# EAGLE design Configurable_RC_Filter (EAGLE 9.5.2)
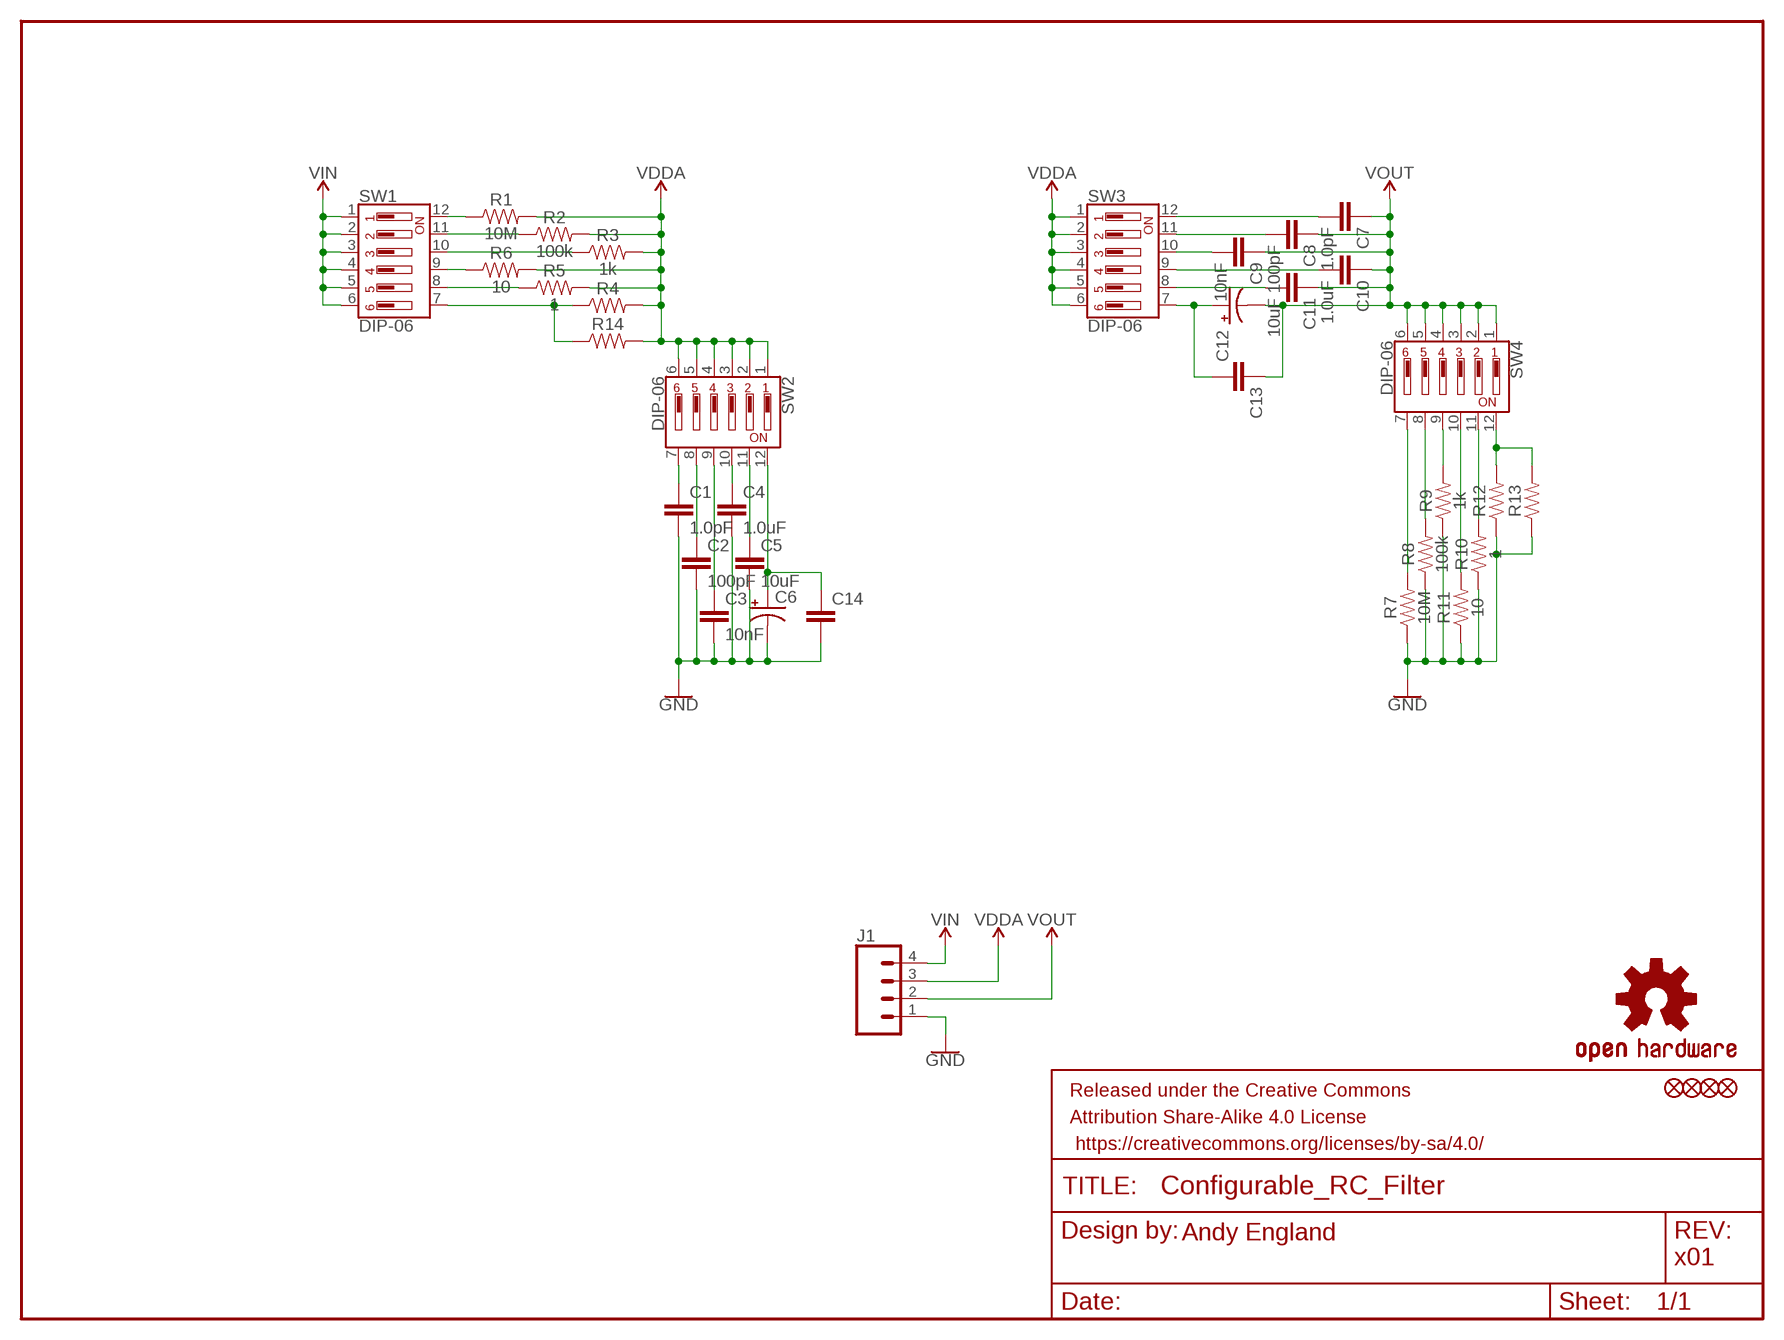
[diagram p0: schematic, sheet 1]

## Parts
C1  1.0pF  1.0PF-0603-50V-25%  [0603]
C2  100pF  100PF-0603-50V-5%  [0603]
C3  10nF  10NF-0603-50V-10%  [0603]
C4  1.0uF  1.0UF-0603-16V-10%  [0603]
C5  10uF  10UF-0603-6.3V-20%  [0603]
C6  1000UF-RADIAL-5MM-25V-20%-NO-SILK  [CPOL-RADIAL-5MM-10MM-NS]
C7  1.0pF  1.0PF-0603-50V-25%  [0603]
C8  100pF  100PF-0603-50V-5%  [0603]
C9  10nF  10NF-0603-50V-10%  [0603]
C10  1.0uF  1.0UF-0603-16V-10%  [0603]
C11  10uF  10UF-0603-6.3V-20%  [0603]
C12  1000UF-RADIAL-5MM-25V-20%-NO-SILK  [CPOL-RADIAL-5MM-10MM-NS]
C13  CAP-0603  [0603]
C14  CAP-0603  [0603]
FD1  FIDUCIAL1X2  [FIDUCIAL-1X2]
FD2  FIDUCIAL1X2  [FIDUCIAL-1X2]
FD3  FIDUCIAL1X2  [FIDUCIAL-1X2]
FD4  FIDUCIAL1X2  [FIDUCIAL-1X2]
FRAME1  FRAME-LETTER  [CREATIVE_COMMONS]
J1  CONN_041X04_NO_SILK  [1X04_NO_SILK]
LOGO1  OSHW-LOGOS  [OSHW-LOGO-S]
R1  10M  10MOHM-0603-1/10W-5%  [0603]
R2  100k  100KOHM-0603-1/10W-1%  [0603]
R3  1k  1KOHM-0603-1/10W-1%  [0603]
R4  RESISTORAXIAL-0.3  [AXIAL-0.3]
R5  1  1OHM-0603-1/10W-1%  [0603]
R6  10  10OHM-0603-1/10W-1%  [0603]
R7  10M  10MOHM-0603-1/10W-5%  [0603]
R8  100k  100KOHM-0603-1/10W-1%  [0603]
R9  1k  1KOHM-0603-1/10W-1%  [0603]
R10  1  1OHM-0603-1/10W-1%  [0603]
R11  10  10OHM-0603-1/10W-1%  [0603]
R12  RESISTORAXIAL-0.3  [AXIAL-0.3]
R13  RESISTOR0603  [0603]
R14  RESISTOR0603  [0603]
SW1  DIP-06  [DIPSWITCH-06-SMD]
SW2  DIP-06  [DIPSWITCH-06-SMD]
SW3  DIP-06  [DIPSWITCH-06-SMD]
SW4  DIP-06  [DIPSWITCH-06-SMD]

## Nets
GND: C1.2 C2.2 C3.2 C4.2 C5.2 C6.- C14.2 J1.1 R7.1 R8.1 R9.1 R10.1 R11.1 R12.P$1 R13.1
N$1: R1.1 SW1.12
N$2: R2.1 SW1.11
N$3: C1.1 SW2.7
N$4: R3.1 SW1.10
N$5: R6.1 SW1.9
N$6: R5.1 SW1.8
N$7: R4.P$1 R14.1 SW1.7
N$8: C2.1 SW2.8
N$9: C3.1 SW2.9
N$10: C4.1 SW2.10
N$11: C5.1 SW2.11
N$12: C6.+ C14.1 SW2.12
N$13: C12.+ C13.2 SW3.7
N$14: C11.2 SW3.8
N$15: C10.2 SW3.9
N$16: C9.2 SW3.10
N$17: C8.2 SW3.11
N$18: C7.2 SW3.12
N$19: R7.2 SW4.7
N$20: R8.2 SW4.8
N$21: R9.2 SW4.9
N$22: R12.P$2 R13.2 SW4.12
N$23: R10.2 SW4.11
N$24: R11.2 SW4.10
VDDA: J1.3 R1.2 R2.2 R3.2 R4.P$2 R5.2 R6.2 R14.2 SW2.1 SW2.2 SW2.3 SW2.4 SW2.5 SW2.6 SW3.1 SW3.2 SW3.3 SW3.4 SW3.5 SW3.6
VIN: J1.4 SW1.1 SW1.2 SW1.3 SW1.4 SW1.5 SW1.6
VOUT: C7.1 C8.1 C9.1 C10.1 C11.1 C12.- C13.1 J1.2 SW4.1 SW4.2 SW4.3 SW4.4 SW4.5 SW4.6

## Notes on the sheet
- Andy England
- x01

## Library data of the parts
C1 C7 = SparkFun-Capacitors:1.0PF: 1pF ceramic capacitors A capacitor is a passive two-terminal electrical component used to store electrical energy temporarily in an electric field.; PROD_ID: CAP-07879
C2 C8 = SparkFun-Capacitors:100PF: 100pF/0.1nF ceramic capacitors A capacitor is a passive two-terminal electrical component used to store electrical energy temporarily in an electric field.; PROD_ID: CAP-07883
C3 C9 = SparkFun-Capacitors:10NF: 0.01uF/10nF/10,000pF ceramic capacitors A capacitor is a passive two-terminal electrical component used to store electrical energy temporarily in an electric field. CAP-09321; PROD_ID: CAP-00867
C4 C10 = SparkFun-Capacitors:1.0UF: 1µF ceramic capacitors A capacitor is a passive two-terminal electrical component used to store electrical energy temporarily in an electric field.; PROD_ID: CAP-00868
C5 C11 = SparkFun-Capacitors:10UF: 10.0µF ceramic capacitors A capacitor is a passive two-terminal electrical component used to store electrical energy temporarily in an electric field.; PROD_ID: CAP-11015
C6 C12 = SparkFun-Capacitors:1000UF: 1,000µF/1mF ceramic capacitors A capacitor is a passive two-terminal electrical component used to store electrical energy temporarily in an electric field. CAP-08070
C13 C14 = SparkFun-Capacitors:CAP
FD1-FD4 = SparkFun-Aesthetics:FIDUCIAL: Fiducial Alignment Points Point-of-reference for pick-and-place machines and other optical instruments.
FRAME1 = SparkFun-Aesthetics:FRAME-LETTER: Schematic Frame - Letter Standard 8.5x11 US Letter frame
J1 = SparkFun-Connectors:CONN_04: Multi connection point. Often used as Generic Header-pin footprint for 0.1 inch spaced/style header connections On any of the 0.1 inch spaced packages, you can populate with these: Break Away Headers - Straight <https://www.sparkfun.com/products/116> (PRT-00116) Break Away Male Headers - Right Angle <https://www.sparkfun.com/products/553> (PRT-00553) Female Headers <https://www.sparkfun.com/products/115> (PRT-00115) Break Away Headers - Machine Pin <https://www.sparkfun.com/products/117> (PRT-00117) Break Away Female Headers - Swiss Machine Pin <https://www.sparkfun.com/products/743> (PRT-00743) For SCREWTERMINALS and SPRING TERMINALS visit here: Screw Terimnals on SparkFun.com <https://www.sparkfun.com/search/results?term=Screw+Terminals> (5mm/3.5mm/2.54mm spacing) This device is also useful as a general connection point to wire up your design to another part of your project. Our various solder wires solder well into these plated through hole pads. Hook-Up Wire - Assortment (Stranded, 22 AWG) <https://www.sparkfun.com/products/11375> (PRT-11375) Hook-Up Wire - Assortment (Solid Core, 22 AWG) <https://www.sparkfun.com/products/11367> (PRT-11367) View the entire wire category on our website here <https://www.sparkfun.com/categories/141> Special notes: Molex polarized connector foot print use with SKU : PRT-08231 with associated crimp pins and housings. 1MM SMD Version SKU: PRT-10208; PROD_ID: CONN-09696
LOGO1 = SparkFun-Aesthetics:OSHW-LOGO: Open-Source Hardware (OSHW) Logo This logo indicates the piece of hardware it is found on incorporates a OSHW license and/or adheres to the definition of open source hardware found here: http://freedomdefined.org/OSHW
R1 R7 = SparkFun-Resistors:10MOHM: RES-09327; PROD_ID: RES-08283
R2 R8 = SparkFun-Resistors:100KOHM: 100kΩ resistor A resistor is a passive two-terminal electrical component that implements electrical resistance as a circuit element. Resistors act to reduce current flow, and, at the same time, act to lower voltage levels within circuits. - Wikipedia; PROD_ID: RES-07828
R3 R9 = SparkFun-Resistors:1KOHM: 1kΩ resistor A resistor is a passive two-terminal electrical component that implements electrical resistance as a circuit element. Resistors act to reduce current flow, and, at the same time, act to lower voltage levels within circuits. - Wikipedia; PROD_ID: RES-07856
R4 R12-R14 = SparkFun-Resistors:RESISTOR: Generic Resistor Package
R5 R10 = SparkFun-Resistors:1OHM: 1Ω resistor A resistor is a passive two-terminal electrical component that implements electrical resistance as a circuit element. Resistors act to reduce current flow, and, at the same time, act to lower voltage levels within circuits. - Wikipedia; PROD_ID: RES-08269
R6 R11 = SparkFun-Resistors:10OHM: 10Ω resistor A resistor is a passive two-terminal electrical component that implements electrical resistance as a circuit element. Resistors act to reduce current flow, and, at the same time, act to lower voltage levels within circuits. - Wikipedia; PROD_ID: RES-12581
SW1-SW4 = SparkFun-Switches:DIP-06; PROD_ID: SWCH-13756

## Board
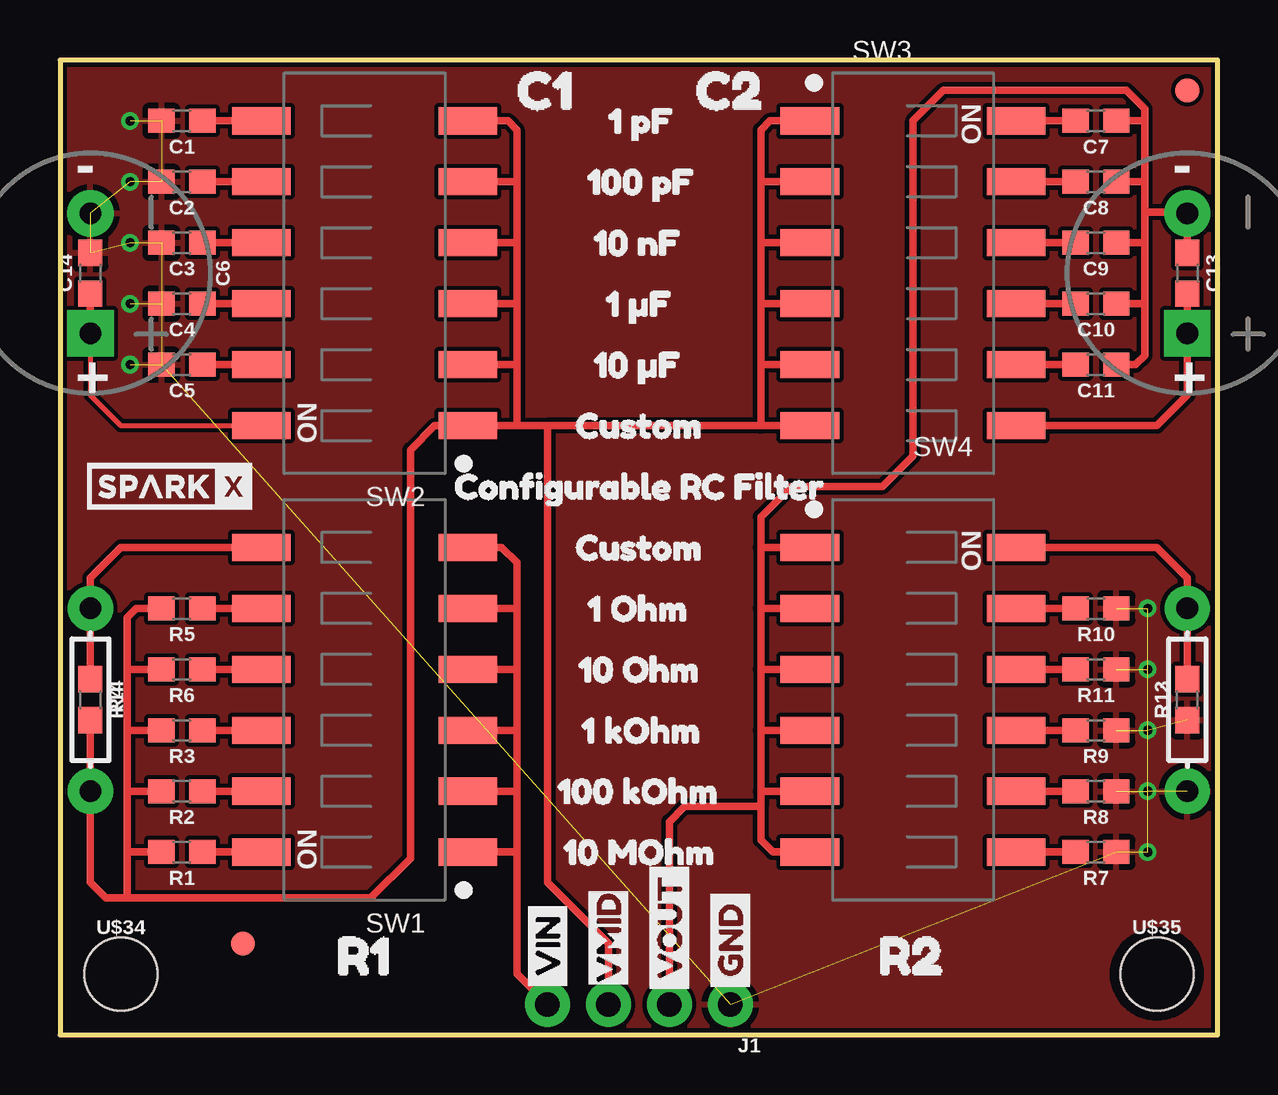
[diagram p1: board, top side]
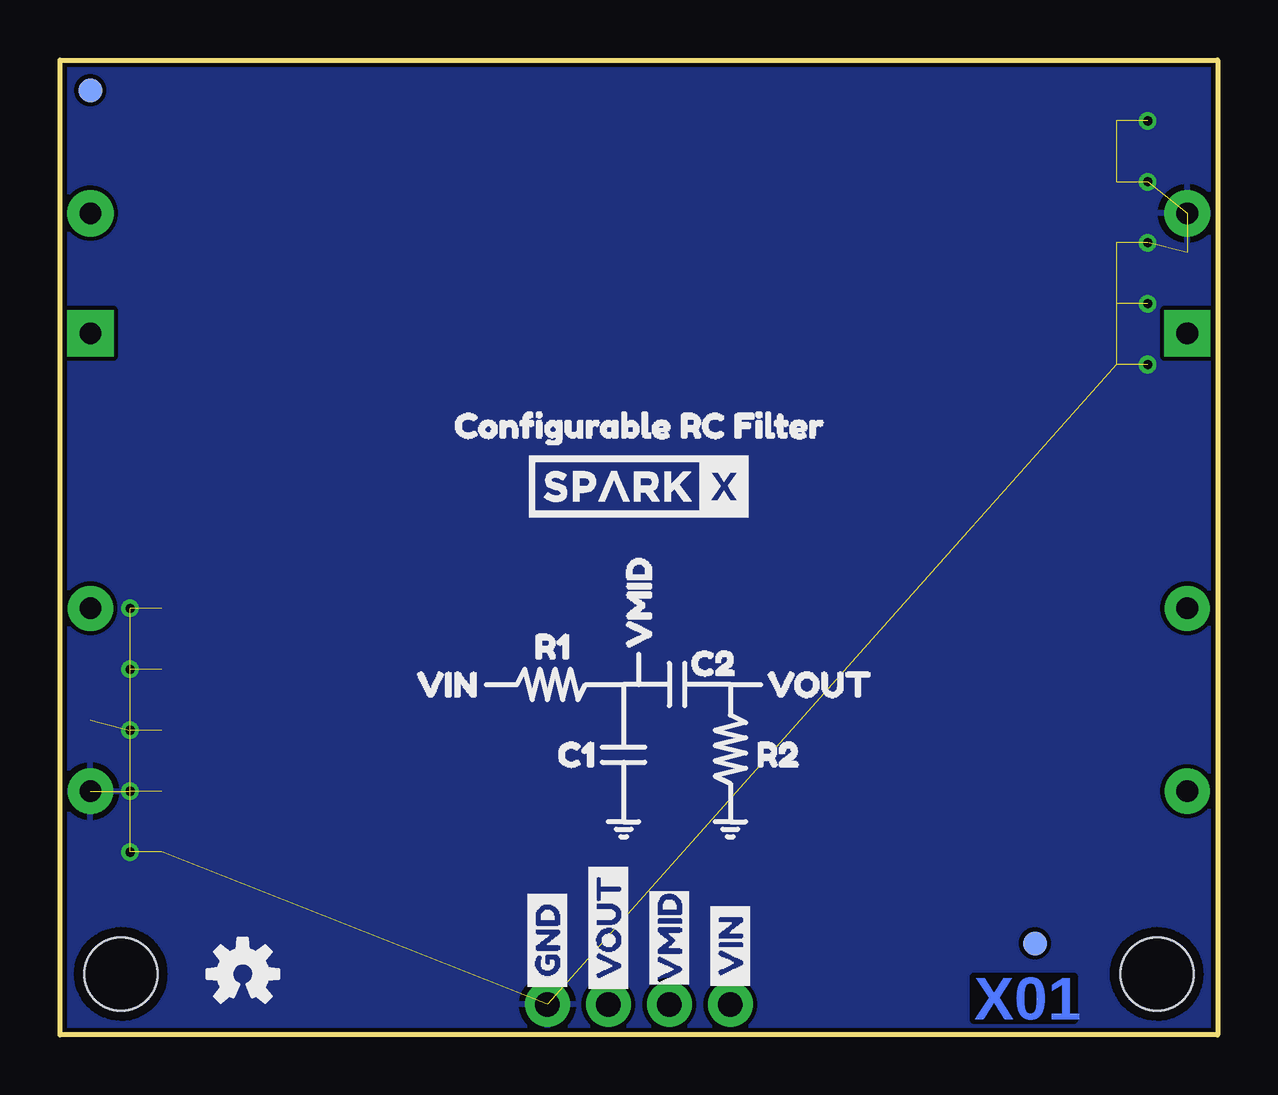
[diagram p2: board, bottom side, seen from below]

Size 48.26 x 40.64 mm. Coordinates in mm from the lower left corner, seen from the top.
Outline: 0,0 48.26,0 48.26,40.64 0.01,40.64 0,0
Copper layers (1*16): Top 0.035mm / dielectric 1.5mm / Bottom 0.035mm
Design rules "SparkFun-2-layer-TIGHT": minimum track width 7mil, minimum drill 15mil, track to track 7mil, track to pad 7mil, pad to pad 7mil, via to via 7mil, smd to smd 7mil, copper to edge 7mil, drill to drill 7mil, minimum pad ring 7mil, minimum via ring 7mil, stop-mask expansion 4mil, vias tented up to drill 25mil, thermal gap 10mil

### Footprints (pad centres in the part's own frame; a part is rotated, then mirrored left to right if it is on the bottom)
0603 = smd 1.1 x 1: 1 -0.85,0; 2 0.85,0
CPOL-RADIAL-5MM-10MM-NS = drill 0.9 pad 1.93 square: + 2.5,0 | drill 0.9 pad 1.93: - -2.5,0
FIDUCIAL-1X2 = smd 1 x 1: 1 0,0
1X04_NO_SILK = drill 1.016 pad 1.88: 1 0,0; 2 2.54,0; 3 5.08,0; 4 7.62,0
AXIAL-0.3 = drill 0.9 pad 1.88: P$1 -3.81,0; P$2 3.81,0
DIPSWITCH-06-SMD = smd 1.13 x 2.44: 1 -6.35,-4.3; 2 -3.81,-4.3; 3 -1.27,-4.3; 4 1.27,-4.3; 5 3.81,-4.3; 6 6.35,-4.3; 7 6.35,4.3; 8 3.81,4.3; 9 1.27,4.3; 10 -1.27,4.3; 11 -3.81,4.3; 12 -6.35,4.3
STAND-OFF-TIGHT = hole 3.048: 0,0

### Placement (x,y rotation side)
C1  5.08,38.1 180 top
C2  5.08,35.56 180 top
C3  5.08,33.02 180 top
C4  5.08,30.48 180 top
C5  5.08,27.94 180 top
C6  1.27,31.75 270 top
C7  43.18,38.1 180 top
C8  43.18,35.56 180 top
C9  43.18,33.02 180 top
C10  43.18,30.48 180 top
C11  43.18,27.94 180 top
C12  46.99,31.75 270 top
C13  46.99,31.75 270 top
C14  1.27,31.75 90 top
FD1  7.62,3.81 0 top
FD2  7.62,3.81 0 bottom
FD3  46.99,39.37 0 top
FD4  46.99,39.37 0 bottom
FRAME1  -1.27,-8.89 0 top  (outside the outline)
J1  27.94,1.27 180 top
LOGO1  40.64,2.54 0 bottom
R1  5.08,7.62 180 top
R2  5.08,10.16 180 top
R3  5.08,12.7 180 top
R4  1.27,13.97 270 top
R5  5.08,17.78 180 top
R6  5.08,15.24 180 top
R7  43.18,7.62 180 top
R8  43.18,10.16 180 top
R9  43.18,12.7 180 top
R10  43.18,17.78 180 top
R11  43.18,15.24 180 top
R12  46.99,13.97 90 top
R13  46.99,13.97 90 top
R14  1.27,13.97 270 top
SW1  12.7,13.97 90 top
SW2  12.7,31.75 90 top
SW3  35.56,31.75 270 top
SW4  35.56,13.97 270 top
U$1  [1_#F9]  21.84,30.48 0 top
U$2  [1_KOHM7]  20.83,12.7 0 top
U$3  [10_#F8]  21.34,27.94 0 top
U$4  [10_MOHM6]  20.07,7.62 0 top
U$5  [GND0]  27.94,1.52 90 top
U$6  [GND0]  27.94,1.52 90 bottom
U$7  [VIN1]  20.32,1.52 90 top
U$8  [VIN1]  20.32,1.52 90 bottom
U$9  [VMID3]  22.86,1.27 90 top
U$10  [VMID3]  22.86,1.27 90 bottom
U$11  [VOUT3]  25.4,1.4 90 top
U$12  [VOUT3]  25.4,1.4 90 bottom
U$13  [10_NF11]  21.34,33.02 0 top
U$14  [10_OHM4]  20.7,15.24 0 top
U$15  [100_KOHM10]  19.81,10.16 0 top
U$16  [C10]  17.65,39.37 0 top
U$17  [C21]  25.15,39.37 0 top
U$18  [R12]  10.16,3.3 0 top
U$19  [R23]  32.77,3.3 0 top
U$20  [_1_OHM5]  20.7,17.78 0 top
U$21  [_1_PF13]  21.59,38.1 0 top
U$22  [_100_PF12]  20.7,35.56 0 top
U$23  [CUSTOM3]  20.57,20.32 0 top
U$24  [CUSTOM3]  20.57,25.4 0 top
U$25  [C11]  28.45,11.68 0 bottom
U$26  [C20]  22.86,15.49 0 bottom
U$27  [R12]  29.4,16.19 0 bottom
U$28  [R23]  20.13,11.68 0 bottom
U$29  [VIN4]  34.29,14.61 0 bottom
U$30  [VMID5]  24.13,15.24 90 bottom
U$31  [VOUT6]  19.68,14.61 0 bottom
U$32  [CONFIGURABLE_RC_FILTER0]  15.56,22.86 0 top
U$33  [CONFIGURABLE_RC_FILTER0]  32.7,25.4 0 bottom
U$34  [STAND-OFF-TIGHT]  2.54,2.54 0 top
U$35  [STAND-OFF-TIGHT]  45.72,2.54 0 top
U$36  [SPARKX-SMALL]  4.57,22.86 0 top
U$37  [SPARKX-MEDIUM]  24.13,22.86 0 bottom

### Tracks (layer width: path | path; a pad name or v marks a point on that pad's centre or on a via)
GND  (via drill 0.38)  (24 unrouted)
  other vias: 45.34,17.78 45.34,15.24 45.34,12.7 45.34,10.16 45.34,7.62 2.92,38.1 2.92,35.56 2.92,33.02 2.92,30.48 2.92,27.94
  pour Top: 0,40.64 48.26,40.64 48.26,0 0,0
  pour Bottom: 48.26,40.64 0,40.64 0,0 48.26,0
N$1
  Top 0.305: R1.1 SW1.12
N$2
  Top 0.305: R2.1 SW1.11
N$3
  Top 0.305: SW2.7 C1.1
N$4
  Top 0.305: R3.1 SW1.10
N$5
  Top 0.305: R6.1 SW1.9
N$6
  Top 0.305: R5.1 SW1.8
N$7
  Top 0.305: SW1.7 2.54,20.32 1.27,19.05 R4.P$1 R14.1
N$8
  Top 0.305: C2.1 SW2.8
N$9
  Top 0.305: C3.1 SW2.9
N$10
  Top 0.305: C4.1 SW2.10
N$11
  Top 0.305: C5.1 SW2.11
N$12
  Top 0.203: C6.+ 1.27,26.67 2.54,25.4 SW2.12
  Top 0.305: C6.+ C14.1
N$13
  Top 0.305: SW3.7 45.72,25.4 46.99,26.67 C12.+ C13.2
N$14
  Top 0.305: SW3.8 C11.2
N$15
  Top 0.305: C10.2 SW3.9
N$16
  Top 0.305: SW3.10 C9.2
N$17
  Top 0.305: SW3.11 C8.2
N$18
  Top 0.305: C7.2 SW3.12
N$19
  Top 0.305: SW4.7 R7.2
N$20
  Top 0.305: R8.2 SW4.8
N$21
  Top 0.305: SW4.9 R9.2
N$22
  Top 0.305: SW4.12 45.72,20.32 46.99,19.05 R12.P$2 R13.2
N$23
  Top 0.305: R10.2 SW4.11
N$24
  Top 0.305: SW4.10 R11.2
VDDA
  Top 0.305: R5.2 3.17,17.78 2.79,17.4 2.79,15.24 | 2.79,15.24 2.79,12.7 | 2.79,12.7 2.79,10.16 | 2.79,10.16 2.79,7.62 | 2.79,7.62 2.79,5.71 | R2.2 2.79,10.16 | R3.2 2.79,12.7 | R6.2 2.79,15.24 | 2.79,5.71 1.91,5.71 1.27,6.35 R4.P$2 R14.2 | 2.79,5.71 12.95,5.71 14.61,7.37 14.61,24.38 15.62,25.4 SW2.1 19.05,25.4 | SW2.5 19.05,35.56 | 19.05,35.56 19.05,33.02 | 19.05,33.02 19.05,30.48 | 19.05,30.48 19.05,27.94 | 19.05,27.94 19.05,25.4 | SW2.2 19.05,27.94 | SW2.3 19.05,30.48 | SW2.4 19.05,33.02 | SW2.6 18.67,38.1 19.05,37.72 19.05,35.56 | SW3.1 29.59,38.1 29.21,37.72 29.21,35.56 | 29.21,25.4 29.21,27.94 | 29.21,27.94 29.21,30.48 | 29.21,30.48 29.21,33.02 | 29.21,33.02 29.21,35.56 | SW3.6 29.21,25.4 | SW3.5 29.21,27.94 | SW3.4 29.21,30.48 | SW3.3 29.21,33.02 | SW3.2 29.21,35.56 | 19.05,25.4 20.32,25.4 | J1.3 22.86,3.81 20.32,6.35 20.32,25.4 | 29.21,25.4 20.32,25.4 | 2.79,7.62 R1.2
VIN
  Top 0.305: SW1.6 18.41,20.32 19.05,19.68 19.05,17.78 | 19.05,15.24 19.05,17.78 | SW1.5 19.05,17.78 | SW1.4 19.05,15.24 | J1.4 19.05,2.54 19.05,7.62 | 19.05,15.24 19.05,12.7 | 19.05,12.7 19.05,10.16 | 19.05,10.16 19.05,7.62 | SW1.1 19.05,7.62 | SW1.2 19.05,10.16 | SW1.3 19.05,12.7
VOUT
  Top 0.305: SW4.6 29.72,7.62 29.21,8.13 29.21,9.53 | J1.2 25.4,8.89 26.04,9.53 29.21,9.53 | C11.1 44.83,27.94 45.21,28.32 45.21,30.48 | 45.21,30.48 45.21,33.02 | 45.21,33.02 45.21,34.29 | 45.21,34.29 45.21,35.56 | 45.21,35.56 45.21,38.1 | C10.1 45.21,30.48 | C9.1 45.21,33.02 | C8.1 45.21,35.56 | C7.1 45.21,38.1 | 45.21,34.29 46.95,34.29 C12.- C13.1 | 45.21,38.1 45.21,38.61 44.45,39.37 36.83,39.37 35.56,38.1 35.56,24.13 34.29,22.86 30.48,22.86 29.21,21.59 29.21,20.32 | 29.21,20.32 29.21,17.78 | 29.21,17.78 29.21,15.24 | 29.21,15.24 29.21,12.7 | 29.21,12.7 29.21,10.16 | 29.21,10.16 29.21,9.53 | SW4.2 29.21,17.78 | SW4.3 29.21,15.24 | SW4.4 29.21,12.7 | SW4.5 29.21,10.16 | SW4.1 29.21,20.32

### Text on the board
Bottom: X01
tPlace: - | - | + | +
tDocu: Andy England